# Altium schematic sheet ZHSD-RS485-CAN.SchDoc
size A4; DocumentNumber: 13; SheetNumber: 13; SheetTotal: 17; Size: A4
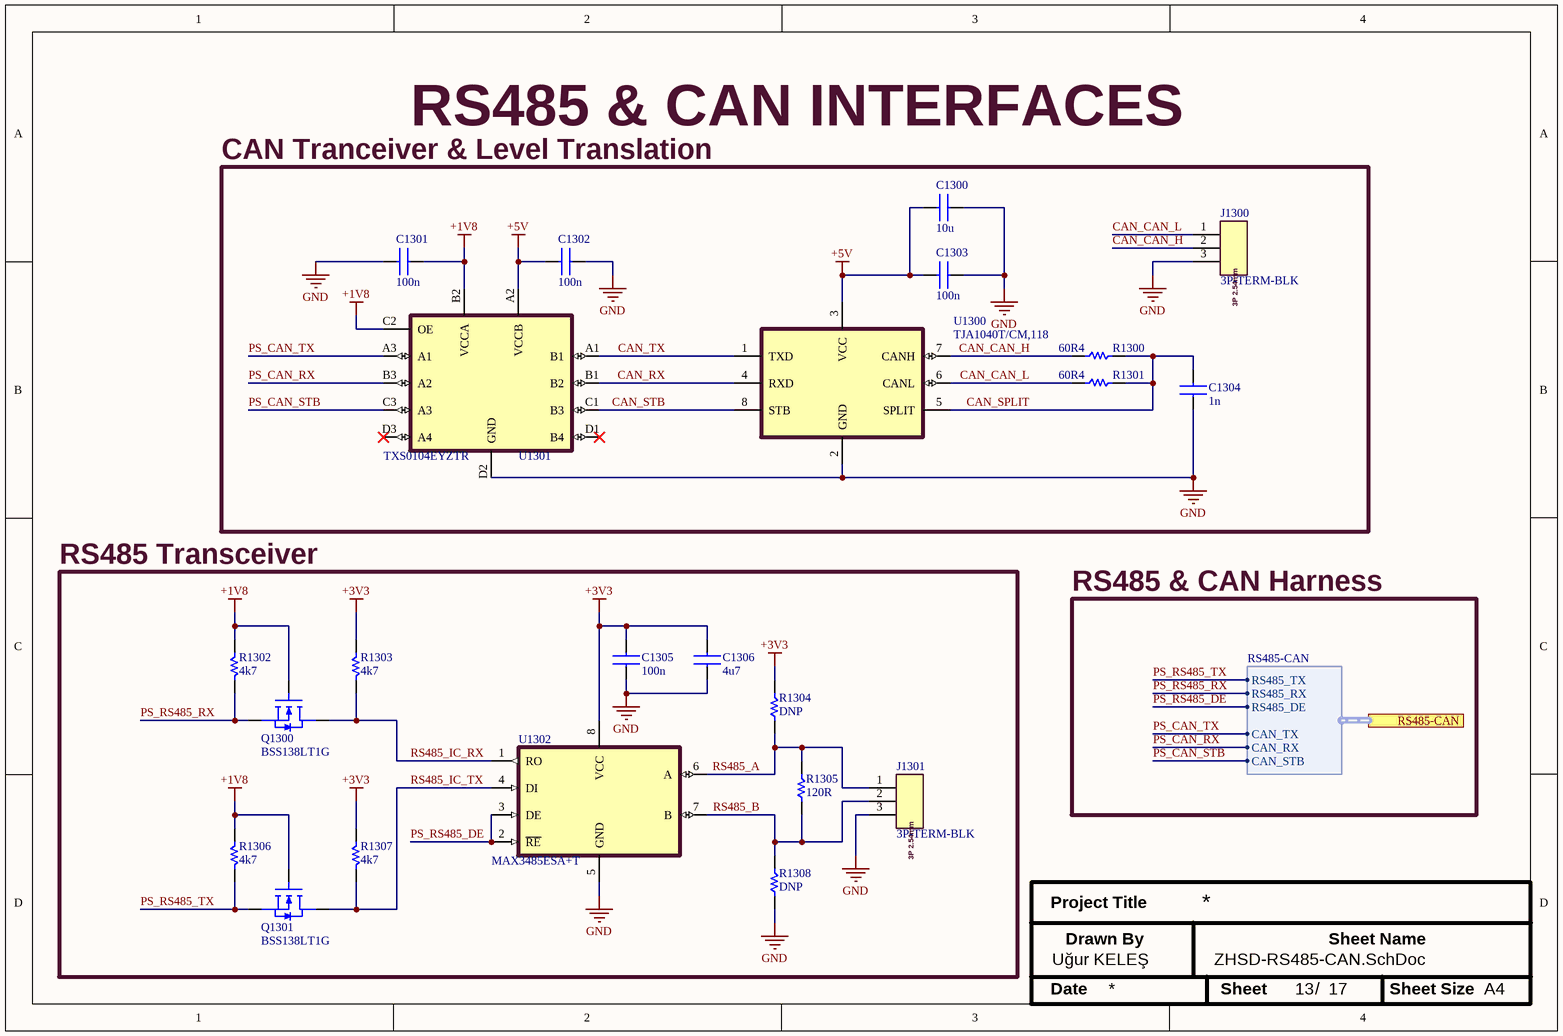
[diagram p0: ZHSD-RS485-CAN.SchDoc]

## Parts
C1300  10u  [0603CAPC1608X09N]
C1301  100n  [0603CAPC1608X09N]
C1302  100n  [0603CAPC1608X09N]
C1303  100n  [0603CAPC1608X09N]
C1304  1n  [0603CAPC1608X09N]
C1305  100n  [0603CAPC1608X09N]
C1306  4u7  [0603CAPC1608X09N]
J1300  3P-TERM-BLK  [CONN-3P-TERM-BLK]
J1301  3P-TERM-BLK  [CONN-3P-TERM-BLK]
Q1300  BSS138LT1G  [SOT95P237X89-3N]
Q1301  BSS138LT1G  [SOT95P237X89-3N]
R1300  60R4  [0402RESC1005X04N]
R1301  60R4  [0402RESC1005X04N]
R1302  4k7  [0402RESC1005X04N]
R1303  4k7  [0402RESC1005X04N]
R1304  DNP  [0402RESC1005X04N]
R1305  120R  [0402RESC1005X04N]
R1306  4k7  [0402RESC1005X04N]
R1307  4k7  [0402RESC1005X04N]
R1308  DNP  [0402RESC1005X04N]
U1300  TJA1040T/CM,118  [SOIC127P600X175-8N]
U1301  TXS0104EYZTR  [BGA12C50P3X4]
U1302  MAX3485ESA+T  [SOIC127P600X175-8N]

## Blocks framed on the sheet
CAN Tranceiver & Level Translation: C1300-C1304 J1300 R1300 R1301 U1300 U1301
RS485 Transceiver: C1305 C1306 J1301 Q1300 Q1301 R1302-R1308 U1302

## Ports
RS485-CAN (harness RS485-CAN, see ZHSD-Block[3600,3000], ZHSD-ZYNQ-MIO[10100,7700])

## Harnesses
RS485-CAN: RS485_TX, RS485_RX, RS485_DE, CAN_TX, CAN_RX, CAN_STB

## Nets
+1V8: C1301.2 Q1300.1(G) Q1301.1(G) R1302.1 R1306.1 U1301.B2(VCCA) U1301.C2(OE)
+3V3: C1305.2 C1306.2 R1303.1 R1304.2 R1307.1 U1302.8(VCC)
+5V: C1300.2 C1302.2 C1303.2 U1300.3(VCC) U1301.A2(VCCB)
GND: C1300.1 C1301.1 C1302.1 C1303.1 C1304.1 C1305.1 C1306.1 J1300.3 J1301.3 R1308.1 U1300.2(GND) U1301.D2(GND) U1302.5(GND)
CAN_CAN_H: J1300.2 R1300.1 U1300.7(CANH)
CAN_CAN_L: J1300.1 R1301.1 U1300.6(CANL)
CAN_RX: U1300.4(RXD) U1301.B1(B2)
CAN_SPLIT: C1304.2 R1300.2 R1301.2 U1300.5(SPLIT)
CAN_STB: U1300.8(STB) U1301.C1(B3)
CAN_TX: U1300.1(TXD) U1301.A1(B1)
PS_CAN_RX: U1301.B3(A2) ; port RS485-CAN.CAN_RX
PS_CAN_STB: U1301.C3(A3) ; port RS485-CAN.CAN_STB
PS_CAN_TX: U1301.A3(A1) ; port RS485-CAN.CAN_TX
PS_RS485_DE: U1302.2(~{RE}) U1302.3(DE) ; port RS485-CAN.RS485_DE
PS_RS485_RX: Q1300.2(S) R1302.2 ; port RS485-CAN.RS485_RX
PS_RS485_TX: Q1301.2(S) R1306.2 ; port RS485-CAN.RS485_TX
RS485_A: J1301.1 R1304.1 R1305.2 U1302.6(A)
RS485_B: J1301.2 R1305.1 R1308.2 U1302.7(B)
RS485_IC_RX: Q1300.3(D) R1303.2 U1302.1(RO)
RS485_IC_TX: Q1301.3(D) R1307.2 U1302.4(DI)

Not connected (* = marked no-connect by the designer): U1301 D1(B4)* D3(A4)*

## Notes on the sheet
- RS485 & CAN INTERFACES
- RS485 & CAN Harness
- Project Title
- Uğur KELEŞ
- Drawn By
- Sheet Name
- Date
- Sheet
- /
- Sheet Size
- A4
- (in symbol 282834-3) 3P 2.54mm

## Library data of the parts
C1300 = GRM188Z71A106MA73D: CAP CER 10UF 10V X7R 0603 (1608) ±20%; Manufacturer: Murata Electronics; Value: 10 µF; ComponentLink1Description: Datasheet; ComponentLink1URL: https://search.murata.co.jp/Ceramy/image/img/A01X/G101/ENG/GRM188Z71A106MA73-01A.pdf; MPN: GRM188Z71A106MA73D; Package: 0603; Tolerance: ±20%; Voltage: 10V
C1301-C1303 C1305 = GRM155R71C104KA88J: CAP CER 0.1UF 16V X7R 0402 (1005) ±10%; Manufacturer: Murata Electronics; Value: 0.1 µF; ComponentLink1Description: Datasheet; ComponentLink1URL: https://search.murata.co.jp/Ceramy/image/img/A01X/G101/ENG/GRM155R71C104KA88-01.pdf; MPN: GRM155R71C104KA88J; Package: 0402; Tolerance: ±10%; Voltage: 16V
C1304 = GCM188R71H102KA37D: CAP CER 1000PF 50V X7R 0603 (1608) ±10%; Manufacturer: Murata Electronics; ComponentLink1Description: Datasheet; ComponentLink1URL: https://search.murata.co.jp/Ceramy/image/img/A01X/G101/ENG/GCM188R71H102KA37-01.pdf; MPN: GCM188R71H102KA37D; Package: 0603; Tolerance: ±10%; Value: 1000 pF; Voltage: 50V
C1306 = CL10A475KP8NNNC: CAP CER 4.7UF 10V X5R 0603 (1608) ±10%; Manufacturer: Samsung Electro-Mechanics; Value: 4.7 µF; ComponentLink1Description: Datasheet; ComponentLink1URL: https://mm.digikey.com/Volume0/opasdata/d220001/medias/docus/609/CL10A475KP8NNNC_Spec.pdf; MPN: CL10A475KP8NNNC; Package: 0603; Tolerance: ±10%; Voltage: 10V
J1300 J1301 = 282834-3: TERM BLK 3P SIDE ENT 2.54MM PCB
Q1300 Q1301 = BSS138LT1G: N-Channel 50 V 200mA (Ta) 225mW (Ta) Surface Mount SOT-23-3 (TO-236); Manufacturer: onsemi; Drain to Source Voltage (Vdss): 50 V; Rds On (Max) @ Id, Vgs: 3.5Ohm @ 200mA, 5V; Vgs (Max): ±20V; ComponentLink1Description: Datasheet; ComponentLink1URL: https://www.onsemi.com/pdf/datasheet/bss138lt1-d.pdf; MPN: BSS138LT1G; Package: SOT-23-3
R1300 R1301 = RC0402FR-0760R4L: RES 60.4 OHM 1% 1/16W 0402 (1005); Manufacturer: YAGEO; Value: 60.4 Ohms; Voltage: 50V; ComponentLink1Description: Datasheet; ComponentLink1URL: https://yageogroup.com/content/datasheet/asset/file/PYU-RC_GROUP_51_ROHS_L; MPN: RC0402FR-0760R4L; Tolerance: ±1%; Package: 0402
R1302 R1303 R1306 R1307 = RC0402JR-074K7L: RES 4.7K OHM 5% 1/16W 0402 (1005); Manufacturer: YAGEO; MPN: RT0402FRE0780RL; Value: 4.7 kOhms; Voltage: 50V; ComponentLink1Description: Datasheet; ComponentLink1URL: https://yageogroup.com/content/datasheet/asset/file/PYU-RC_GROUP_51_ROHS_L; Tolerance: ±5%; Package: 0402
R1304 R1308 = DNP_RES: DO NOT POPULATE RESISTOR; Manufacturer: ***; Value: ***; ComponentLink1Description: Datasheet; ComponentLink1URL: https://yageogroup.com/content/datasheet/asset/file/PYU-RT_1-TO-0-01_ROHS_L; MPN: ***; Voltage: ***; Tolerance: ***; Package: 0402
R1305 = RC0402FR-07120RL: RES 120 OHM 1% 1/16W 0402 (1005); Manufacturer: YAGEO; Value: 120 Ohms; Voltage: 50V; ComponentLink1Description: Datasheet; ComponentLink1URL: https://yageogroup.com/content/datasheet/asset/file/PYU-RC_GROUP_51_ROHS_L; MPN: RC0402FR-07120RL; Tolerance: ±1%; Package: 0402
U1300 = TJA1040T/CM,118: CAN Interface IC High-Speed CAN Transceiver with Standby Mode SOIC8; Manufacturer: NXP USA Inc.; ComponentLink1Description: Datasheet; ComponentLink1URL: https://www.nxp.com/docs/en/data-sheet/TJA1040.pdf; MPN: TJA1040T/CM,118
U1301 = TXS0104EYZTR: Voltage Level Translator Bidirectional 1 Circuit 4 Channel 24Mbps 12-DSBGA (1.9x1.4); Manufacturer: Texas Instruments; ComponentLink1Description: Datasheet; ComponentLink1URL: https://www.ti.com/lit/ds/symlink/txs0104e.pdf?HQS=dis-dk-null-digikeymode-dsf-pf-null-wwe&ts=1769494565851&ref_url=https%253A%252F%252Fwww.ti.com%252Fgeneral%252Fdocs%252Fsuppproductinfo.tsp%253FdistId%253D10%2526gotoUrl%253Dhttps%253A%252F%252Fwww.ti.com%252Flit%252Fgpn%252Ftxs0104e; MPN: TXS0104EYZTR
U1302 = MAX3485ESA+T: 1/1 Transceiver Half RS422, RS485 8-SOIC; Manufacturer: Analog Devices Inc./Maxim Integrated; ComponentLink1Description: Datasheet; ComponentLink1URL: https://www.analog.com/media/en/technical-documentation/data-sheets/max3483-max3491.pdf; MPN: MAX3485ESA+T